# Altium schematic sheet 01 COVER PAGE.SchDoc: COVER PAGE
size 420 x 297 mm; SheetNumber: 1; SheetTotal: 6
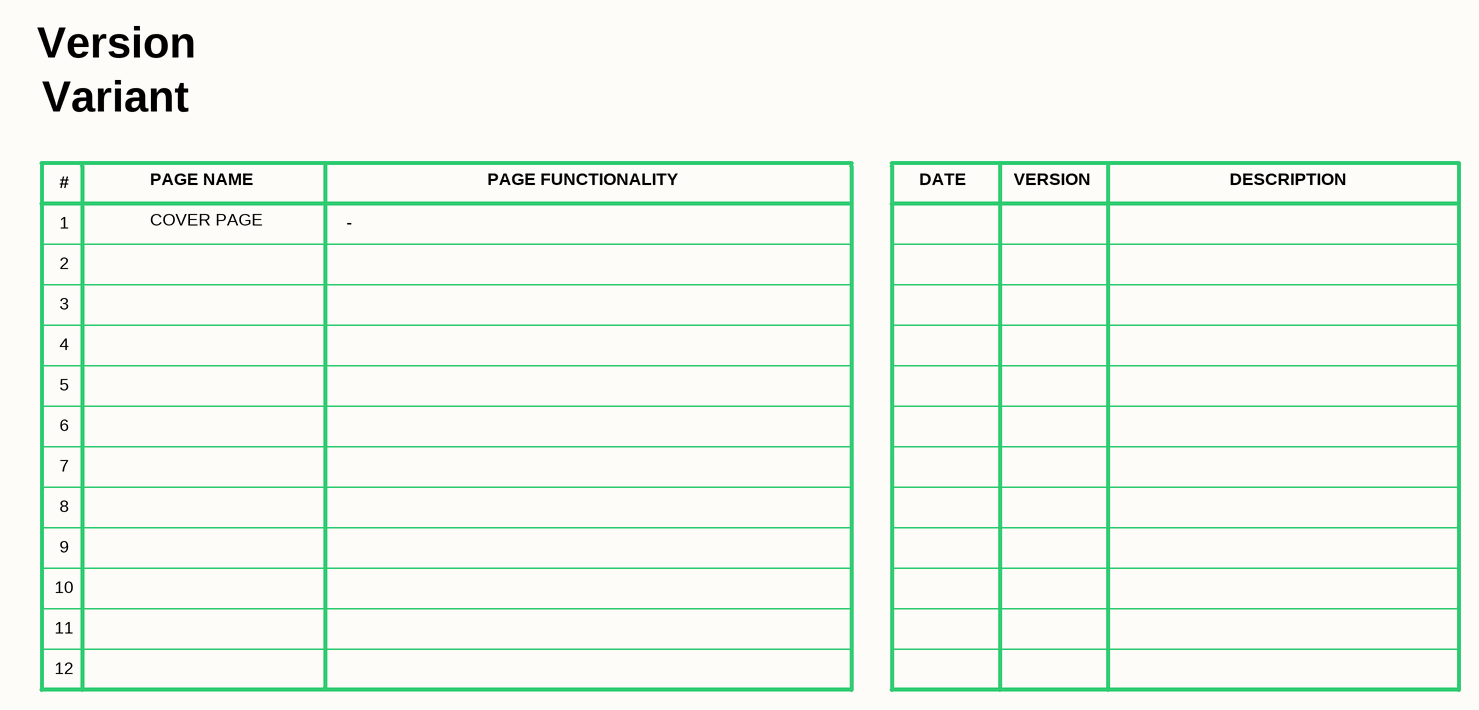
[diagram p0: 01 COVER PAGE.SchDoc]

## Notes on the sheet
- Version
- Variant
- #
- 1
- PAGE NAME
- COVER PAGE
- -
- PAGE FUNCTIONALITY
- DATE
- VERSION
- DESCRIPTION
- 2
- 3
- 4
- 5
- 6
- 7
- 8
- 9
- 10
- 11
- 12
- Title
- Project
- Size
- Date
- Revision
- A3
- Designed By